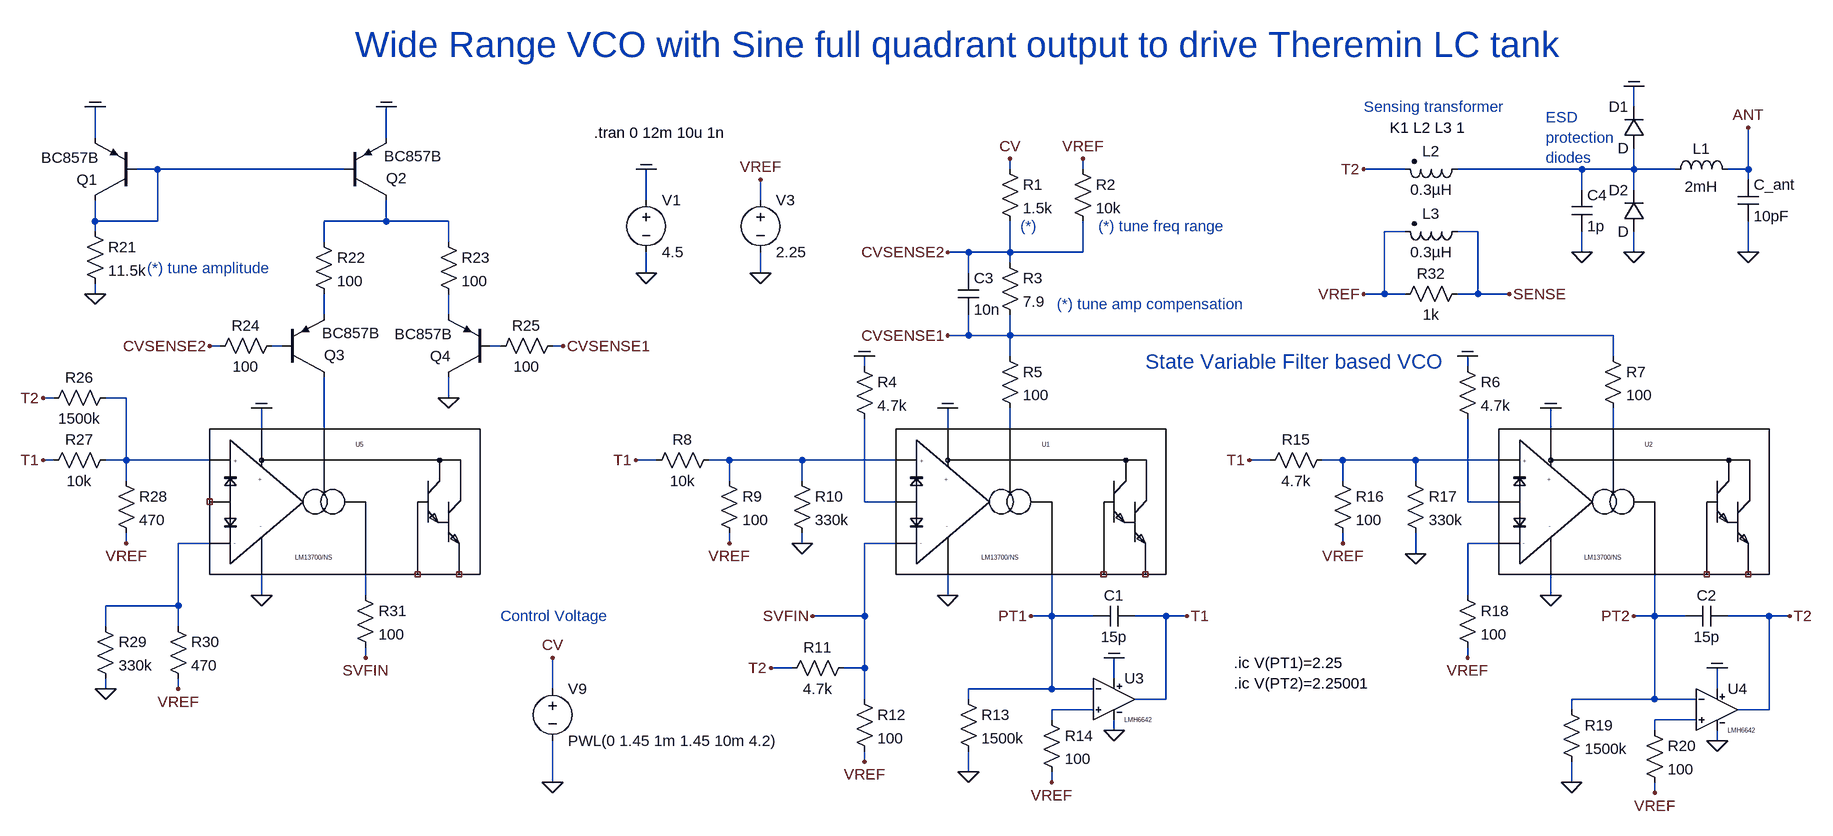
[diagram p0: schematic ota_svf_vco_v02.asc]
ota_svf_vco_v02.asc, the LTspice schematic file:
Version 4
SHEET 1 17540 12720
WIRE 6048 4080 6048 4048
WIRE 3680 4128 3680 4080
WIRE 4128 4128 4128 4080
WIRE 3776 4176 3744 4176
WIRE 4064 4176 3776 4176
WIRE 5088 4176 5088 4160
WIRE 5200 4176 5200 4160
WIRE 5696 4176 5632 4176
WIRE 5968 4176 5776 4176
WIRE 6048 4176 6048 4144
WIRE 6048 4176 5968 4176
WIRE 6112 4176 6048 4176
WIRE 6224 4176 6224 4112
WIRE 6224 4176 6192 4176
WIRE 6224 4192 6224 4176
WIRE 5968 4208 5968 4176
WIRE 6048 4208 6048 4176
WIRE 4528 4224 4528 4176
WIRE 4704 4224 4704 4192
WIRE 3680 4256 3680 4224
WIRE 3776 4256 3776 4176
WIRE 3776 4256 3680 4256
WIRE 4128 4256 4128 4224
WIRE 4128 4256 4032 4256
WIRE 4224 4256 4128 4256
WIRE 3680 4272 3680 4256
WIRE 5696 4272 5664 4272
WIRE 5808 4272 5776 4272
WIRE 4032 4288 4032 4256
WIRE 4224 4288 4224 4256
WIRE 5024 4304 4992 4304
WIRE 5088 4304 5088 4256
WIRE 5088 4304 5024 4304
WIRE 5200 4304 5200 4256
WIRE 5200 4304 5088 4304
WIRE 5968 4304 5968 4272
WIRE 6048 4304 6048 4272
WIRE 6224 4304 6224 4256
WIRE 5088 4320 5088 4304
WIRE 4528 4336 4528 4304
WIRE 4704 4336 4704 4304
WIRE 5024 4336 5024 4304
WIRE 3680 4368 3680 4352
WIRE 5664 4368 5664 4272
WIRE 5664 4368 5632 4368
WIRE 5696 4368 5664 4368
WIRE 5808 4368 5808 4272
WIRE 5808 4368 5776 4368
WIRE 5856 4368 5808 4368
WIRE 4032 4400 4032 4368
WIRE 4224 4400 4224 4368
WIRE 5024 4432 5024 4400
WIRE 5024 4432 4992 4432
WIRE 5088 4432 5088 4400
WIRE 5088 4432 5024 4432
WIRE 6016 4432 5088 4432
WIRE 3872 4448 3856 4448
WIRE 3968 4448 3952 4448
WIRE 4304 4448 4288 4448
WIRE 4400 4448 4384 4448
WIRE 5088 4464 5088 4432
WIRE 6016 4464 6016 4432
WIRE 4864 4480 4864 4464
WIRE 5792 4480 5792 4464
WIRE 3616 4528 3600 4528
WIRE 3728 4528 3696 4528
WIRE 4224 4528 4224 4496
WIRE 3936 4576 3936 4544
WIRE 4032 4576 4032 4496
WIRE 4992 4576 4992 4544
WIRE 5088 4576 5088 4544
WIRE 5920 4576 5920 4544
WIRE 6016 4576 6016 4544
WIRE 3616 4624 3600 4624
WIRE 3728 4624 3728 4528
WIRE 3728 4624 3696 4624
WIRE 3856 4624 3728 4624
WIRE 4544 4624 4512 4624
WIRE 4656 4624 4624 4624
WIRE 4768 4624 4656 4624
WIRE 4912 4624 4768 4624
WIRE 5488 4624 5456 4624
WIRE 5600 4624 5568 4624
WIRE 5712 4624 5600 4624
WIRE 5840 4624 5712 4624
WIRE 3728 4656 3728 4624
WIRE 4656 4656 4656 4624
WIRE 4768 4656 4768 4624
WIRE 5600 4656 5600 4624
WIRE 5712 4656 5712 4624
WIRE 4864 4688 4864 4560
WIRE 4912 4688 4864 4688
WIRE 5792 4688 5792 4560
WIRE 5840 4688 5792 4688
WIRE 3728 4752 3728 4736
WIRE 3856 4752 3808 4752
WIRE 4656 4752 4656 4736
WIRE 4768 4752 4768 4736
WIRE 4912 4752 4864 4752
WIRE 5600 4752 5600 4736
WIRE 5840 4752 5792 4752
WIRE 5712 4768 5712 4736
WIRE 3936 4832 3936 4800
WIRE 4096 4832 4096 4800
WIRE 4992 4832 4992 4800
WIRE 5792 4832 5792 4752
WIRE 5920 4832 5920 4800
WIRE 3808 4848 3808 4752
WIRE 3808 4848 3696 4848
WIRE 4864 4864 4864 4752
WIRE 4864 4864 4784 4864
WIRE 5152 4864 5152 4800
WIRE 5152 4864 5120 4864
WIRE 5216 4864 5152 4864
WIRE 5328 4864 5280 4864
WIRE 5360 4864 5328 4864
WIRE 6080 4864 6080 4800
WIRE 6080 4864 6048 4864
WIRE 6128 4864 6080 4864
WIRE 6256 4864 6192 4864
WIRE 6288 4864 6256 4864
WIRE 3696 4880 3696 4848
WIRE 3808 4880 3808 4848
WIRE 4096 4928 4096 4912
WIRE 5792 4928 5792 4912
WIRE 4752 4944 4720 4944
WIRE 4864 4944 4864 4864
WIRE 4864 4944 4832 4944
WIRE 5248 4960 5248 4928
WIRE 3696 4976 3696 4960
WIRE 3808 4976 3808 4960
WIRE 4384 4976 4384 4928
WIRE 5152 4976 5152 4864
WIRE 5152 4976 5024 4976
WIRE 5216 4976 5152 4976
WIRE 6176 4976 6176 4944
WIRE 4864 4992 4864 4944
WIRE 5024 4992 5024 4976
WIRE 5328 4992 5328 4864
WIRE 5328 4992 5280 4992
WIRE 6080 4992 6080 4864
WIRE 6080 4992 5952 4992
WIRE 6144 4992 6080 4992
WIRE 5216 5008 5152 5008
WIRE 5952 5008 5952 4992
WIRE 6256 5008 6256 4864
WIRE 6256 5008 6208 5008
WIRE 5152 5024 5152 5008
WIRE 6144 5024 6080 5024
WIRE 5248 5040 5248 5024
WIRE 6080 5040 6080 5024
WIRE 6176 5056 6176 5040
WIRE 4864 5088 4864 5072
WIRE 5024 5104 5024 5072
WIRE 4384 5120 4384 5056
WIRE 5152 5120 5152 5104
WIRE 5952 5120 5952 5088
WIRE 6080 5136 6080 5120
FLAG 4528 4336 0
FLAG 4528 4176 COM
FLAG 4704 4336 0
FLAG 4704 4192 VREF
FLAG 6224 4112 ANT
FLAG 6224 4304 0
FLAG 5632 4368 VREF
FLAG 5856 4368 SENSE
FLAG 4992 4832 0
FLAG 4992 4544 COM
FLAG 5248 5040 0
FLAG 5248 4928 COM
FLAG 5152 5120 VREF
FLAG 5360 4864 T1
FLAG 5120 4864 PT1
FLAG 5920 4832 0
FLAG 5920 4544 COM
FLAG 6176 5056 0
FLAG 6176 4944 COM
FLAG 6080 5136 VREF
FLAG 6288 4864 T2
FLAG 6048 4864 PT2
FLAG 4864 5088 VREF
FLAG 4720 4944 T2
FLAG 5792 4928 VREF
FLAG 5600 4752 VREF
FLAG 5456 4624 T1
FLAG 4656 4752 VREF
FLAG 4512 4624 T1
FLAG 4864 4464 COM
FLAG 5792 4464 COM
FLAG 4384 5120 0
FLAG 4384 4928 CV
FLAG 5088 4160 CV
FLAG 5200 4160 VREF
FLAG 4992 4432 CVSENSE1
FLAG 4784 4864 SVFIN
FLAG 3936 4832 0
FLAG 3936 4544 COM
FLAG 4992 4304 CVSENSE2
FLAG 3808 4976 VREF
FLAG 5952 5120 0
FLAG 5024 5104 0
FLAG 4096 4928 SVFIN
FLAG 4400 4448 CVSENSE1
FLAG 3856 4448 CVSENSE2
FLAG 3728 4752 VREF
FLAG 3600 4624 T1
FLAG 3600 4528 T2
FLAG 4768 4752 0
FLAG 5712 4768 0
FLAG 4224 4528 0
FLAG 5632 4176 T2
FLAG 3696 4976 0
FLAG 3680 4368 0
FLAG 3680 4080 COM
FLAG 4128 4080 COM
FLAG 6048 4304 0
FLAG 6048 4048 COM
FLAG 5968 4304 0
SYMBOL voltage 4528 4208 R0
SYMATTR InstName V1
SYMATTR Value 4.5
SYMBOL voltage 4704 4208 R0
SYMATTR InstName V3
SYMATTR Value 2.25
SYMBOL ind 6096 4192 R270
WINDOW 0 32 56 VTop 2
WINDOW 3 5 56 VBottom 2
SYMATTR InstName L1
SYMATTR Value 2mH
SYMATTR SpiceLine Rser=120 Cpar=1pF
SYMBOL Cap 6208 4192 R0
SYMATTR InstName C_ant
SYMATTR Value 10pF
SYMBOL ind2 5792 4160 R90
WINDOW 0 4 56 VBottom 2
WINDOW 3 32 56 VTop 2
SYMATTR InstName L2
SYMATTR Value 0.3µH
SYMATTR SpiceLine Rser=0.1 Cpar=0.1p
SYMBOL ind2 5792 4256 R90
WINDOW 0 4 56 VBottom 2
WINDOW 3 32 56 VTop 2
SYMATTR InstName L3
SYMATTR Value 0.3µH
SYMATTR SpiceLine Rser=0.1 Cpar=0.1p
SYMBOL Res 5792 4352 R90
WINDOW 0 0 56 VBottom 2
WINDOW 3 32 56 VTop 2
SYMATTR InstName R32
SYMATTR Value 1k
SYMBOL LM13700 4992 4688 R0
SYMATTR InstName U1
SYMBOL Cap 5280 4848 R90
WINDOW 0 0 32 VBottom 2
WINDOW 3 32 32 VTop 2
SYMATTR InstName C1
SYMATTR Value 15p
SYMBOL LMH6642 5248 4928 R0
WINDOW 0 16 32 Left 2
SYMATTR InstName U3
SYMBOL LM13700 5920 4688 R0
SYMATTR InstName U2
SYMBOL Cap 6192 4848 R90
WINDOW 0 0 32 VBottom 2
WINDOW 3 32 32 VTop 2
SYMATTR InstName C2
SYMATTR Value 15p
SYMBOL LMH6642 6176 4944 R0
WINDOW 0 16 32 Left 2
SYMATTR InstName U4
SYMBOL Res 4848 4976 R0
SYMATTR InstName R12
SYMATTR Value 100
SYMBOL Res 4848 4928 R90
WINDOW 0 0 56 VBottom 2
WINDOW 3 32 56 VTop 2
SYMATTR InstName R11
SYMATTR Value 4.7k
SYMBOL Res 5776 4816 R0
SYMATTR InstName R18
SYMATTR Value 100
SYMBOL Res 5584 4640 R0
SYMATTR InstName R16
SYMATTR Value 100
SYMBOL Res 5584 4608 R90
WINDOW 0 0 56 VBottom 2
WINDOW 3 32 56 VTop 2
SYMATTR InstName R15
SYMATTR Value 4.7k
SYMBOL Res 4640 4640 R0
SYMATTR InstName R9
SYMATTR Value 100
SYMBOL Res 4640 4608 R90
WINDOW 0 0 56 VBottom 2
WINDOW 3 32 56 VTop 2
SYMATTR InstName R8
SYMATTR Value 10k
SYMBOL Res 5072 4448 R0
SYMATTR InstName R5
SYMATTR Value 100
SYMBOL Res 6000 4448 R0
SYMATTR InstName R7
SYMATTR Value 100
SYMBOL Res 4848 4464 R0
SYMATTR InstName R4
SYMATTR Value 4.7k
SYMBOL Res 5776 4464 R0
SYMATTR InstName R6
SYMATTR Value 4.7k
SYMBOL Voltage 4384 4960 R0
SYMATTR InstName V9
SYMATTR Value PWL(0 1.45 1m 1.45 10m 4.2)
SYMBOL Res 5072 4160 R0
SYMATTR InstName R1
SYMATTR Value 1.5k
SYMBOL Res 5184 4160 R0
SYMATTR InstName R2
SYMATTR Value 10k
SYMBOL LM13700 3936 4688 R0
SYMATTR InstName U5
SYMBOL Res 5072 4304 R0
SYMATTR InstName R3
SYMATTR Value 7.9
SYMBOL Res 3792 4864 R0
SYMATTR InstName R30
SYMATTR Value 470
SYMBOL Res 5936 4992 R0
SYMATTR InstName R19
SYMATTR Value 1500k
SYMBOL Res 5008 4976 R0
SYMATTR InstName R13
SYMATTR Value 1500k
SYMBOL Res 5136 5008 R0
SYMATTR InstName R14
SYMATTR Value 100
SYMBOL Res 6064 5024 R0
SYMATTR InstName R20
SYMATTR Value 100
SYMBOL pnp 4288 4496 R180
WINDOW 0 60 32 Left 2
WINDOW 3 58 66 Left 2
SYMATTR InstName Q4
SYMATTR Value BC857B
SYMBOL pnp 3968 4496 M180
WINDOW 0 64 34 Left 2
WINDOW 3 61 68 Left 2
SYMATTR InstName Q3
SYMATTR Value BC857B
SYMBOL Res 3968 4432 R90
WINDOW 0 0 56 VBottom 2
WINDOW 3 32 56 VTop 2
SYMATTR InstName R24
SYMATTR Value 100
SYMBOL Res 4400 4432 R90
WINDOW 0 0 56 VBottom 2
WINDOW 3 32 56 VTop 2
SYMATTR InstName R25
SYMATTR Value 100
SYMBOL Res 3712 4640 R0
SYMATTR InstName R28
SYMATTR Value 470
SYMBOL Res 3712 4608 R90
WINDOW 0 0 56 VBottom 2
WINDOW 3 32 56 VTop 2
SYMATTR InstName R27
SYMATTR Value 10k
SYMBOL Res 3712 4512 R90
WINDOW 0 0 56 VBottom 2
WINDOW 3 32 56 VTop 2
SYMATTR InstName R26
SYMATTR Value 1500k
SYMBOL Res 4752 4640 R0
SYMATTR InstName R10
SYMATTR Value 330k
SYMBOL Res 5696 4640 R0
SYMATTR InstName R17
SYMATTR Value 330k
SYMBOL Res 3680 4864 R0
SYMATTR InstName R29
SYMATTR Value 330k
SYMBOL pnp 4064 4224 M180
WINDOW 0 64 34 Left 2
WINDOW 3 61 68 Left 2
SYMATTR InstName Q2
SYMATTR Value BC857B
SYMBOL pnp 3744 4224 R180
WINDOW 0 60 32 Left 2
WINDOW 3 58 66 Left 2
SYMATTR InstName Q1
SYMATTR Value BC857B
SYMBOL Res 3664 4256 R0
SYMATTR InstName R21
SYMATTR Value 11.5k
SYMBOL Res 4016 4272 R0
SYMATTR InstName R22
SYMATTR Value 100
SYMBOL Res 4208 4272 R0
SYMATTR InstName R23
SYMATTR Value 100
SYMBOL Res 4080 4816 R0
SYMATTR InstName R31
SYMATTR Value 100
SYMBOL Cap 5008 4336 R0
SYMATTR InstName C3
SYMATTR Value 10n
SYMBOL Diode 6064 4144 R180
WINDOW 0 24 64 Left 2
WINDOW 3 24 0 Left 2
SYMATTR InstName D1
SYMBOL Diode 6064 4272 R180
WINDOW 0 24 64 Left 2
WINDOW 3 24 0 Left 2
SYMATTR InstName D2
SYMBOL Cap 5952 4208 R0
SYMATTR InstName C4
SYMATTR Value 1p
TEXT 4448 4120 Left 2 !.tran 0 12m 10u 1n
TEXT 4080 3984 Left 5 ;Wide Range VCO with Sine full quadrant output to drive Theremin LC tank
TEXT 5672 4112 Left 2 !K1 L2 L3 1
TEXT 5632 4080 Left 2 ;Sensing transformer
TEXT 5296 4472 Left 3 ;State Variable Filter based VCO
TEXT 5432 4936 Left 2 !.ic V(PT1)=2.25\n.ic V(PT2)=2.25001
TEXT 4304 4864 Left 2 ;Control Voltage
TEXT 5104 4264 Left 2 ;(*)
TEXT 5224 4264 Left 2 ;(*) tune freq range
TEXT 3760 4328 Left 2 ;(*) tune amplitude
TEXT 5160 4384 Left 2 ;(*) tune amp compensation
TEXT 5912 4096 Left 2 ;ESD \nprotection\ndiodes

The netlist it stands for:
* ota_svf_vco_v02.asc
V1 COM 0 4.5
V3 VREF 0 2.25
L1 N002 ANT 2mH Rser=120 Cpar=1pF
C_ant ANT 0 10pF
L2 N002 T2 0.3µH Rser=0.1 Cpar=0.1p
L3 SENSE VREF 0.3µH Rser=0.1 Cpar=0.1p
R32 SENSE VREF 1k
XU1 N010 N014 N012 SVFIN PT1 0 NC_01 NC_02 COM LM13700/NS  ; pins Ibias Dio_bias in+ in- out V- buf_in buf_out V+
C1 T1 PT1 15p
XU3 PT1 N019 COM 0 T1 LMH6642  ; pins In- In+ V+ V- OUT
XU2 N011 N015 N013 N017 PT2 0 NC_03 NC_04 COM LM13700/NS  ; pins Ibias Dio_bias in+ in- out V- buf_in buf_out V+
C2 T2 PT2 15p
XU4 PT2 N020 COM 0 T2 LMH6642  ; pins In- In+ V+ V- OUT
R12 SVFIN VREF 100
R11 SVFIN T2 4.7k
R18 N017 VREF 100
R16 N013 VREF 100
R15 N013 T1 4.7k
R9 N012 VREF 100
R8 N012 T1 10k
R5 CVSENSE1 N010 100
R7 CVSENSE1 N011 100
R4 COM N014 4.7k
R6 COM N015 4.7k
V9 CV 0 PWL(0 1.45 1m 1.45 10m 4.2)
R1 CV CVSENSE2 1.5k
R2 VREF CVSENSE2 10k
XU5 N009 NC_05 N008 N016 N018 0 NC_06 NC_07 COM LM13700/NS  ; pins Ibias Dio_bias in+ in- out V- buf_in buf_out V+
R3 CVSENSE2 CVSENSE1 7.9
R30 N016 VREF 470
R19 PT2 0 1500k
R13 PT1 0 1500k
R14 N019 VREF 100
R20 N020 VREF 100
Q4 0 N007 N005 0 BC857B
Q3 N009 N006 N004 0 BC857B
R24 N006 CVSENSE2 100
R25 CVSENSE1 N007 100
R28 N008 VREF 470
R27 N008 T1 10k
R26 N008 T2 1500k
R10 N012 0 330k
R17 N013 0 330k
R29 N016 0 330k
Q2 N003 N001 COM 0 BC857B
Q1 N001 N001 COM 0 BC857B
R21 N001 0 11.5k
R22 N003 N004 100
R23 N003 N005 100
R31 N018 SVFIN 100
C3 CVSENSE2 CVSENSE1 10n
D1 N002 COM D
D2 0 N002 D
C4 N002 0 1p
.model D D
.lib standard.dio
.model NPN NPN
.model PNP PNP
.lib standard.bjt
.tran 0 12m 10u 1n
* Wide Range VCO with Sine full quadrant output to drive Theremin LC tank
K1 L2 L3 1
* Sensing transformer
* State Variable Filter based VCO
.ic V(PT1)=2.25
.ic V(PT2)=2.25001
* Control Voltage
* (*)
* (*) tune freq range
* (*) tune amplitude
* (*) tune amp compensation
* ESD
* protection
* diodes
.lib ns_models.lib
.lib LMH6642.MOD
.backanno
.end